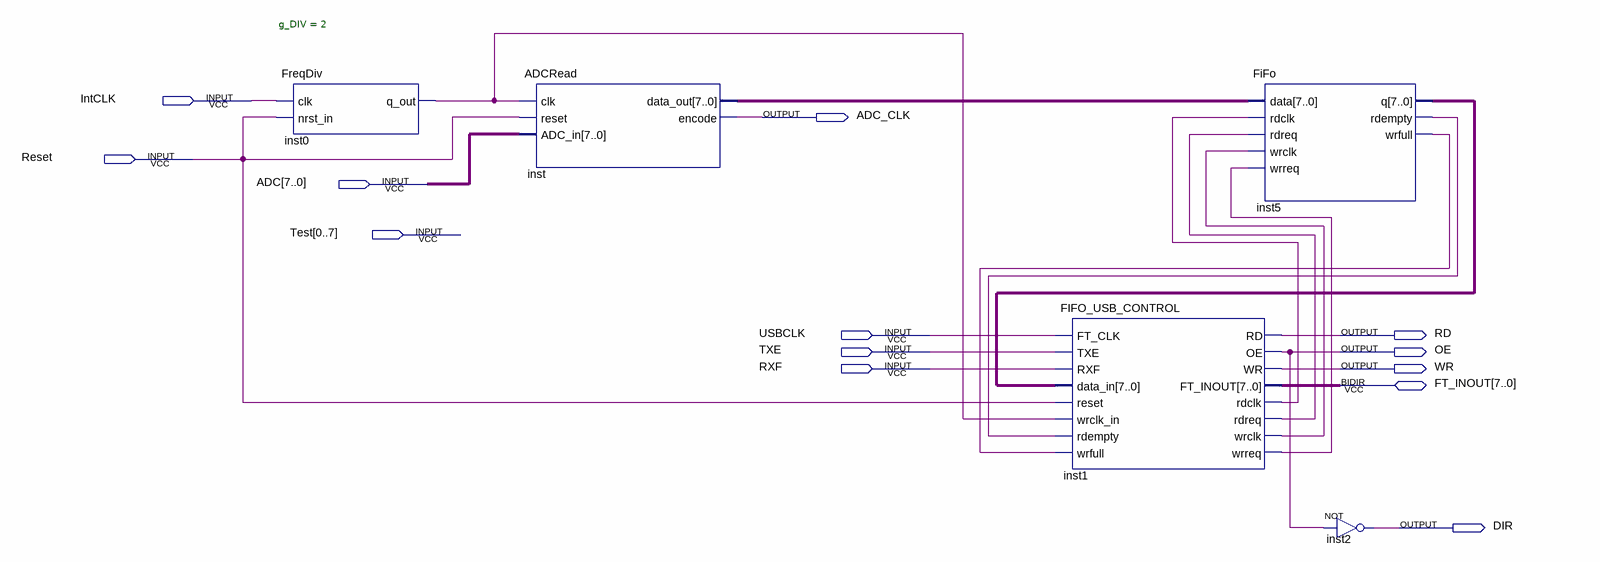
[diagram p0: schematic sheet]
// Quartus schematic ADC_Readout.bdf as structural Verilog: 5 symbols, 13 pins
module ADC_Readout (
  input  IntCLK,
  input  Reset,
  input  [7:0] ADC,
  input  [0:7] Test,
  input  USBCLK,
  input  TXE,
  input  RXF,
  inout  [7:0] FT_INOUT,
  output ADC_CLK,
  output RD,
  output OE,
  output WR,
  output DIR
);

  wire inst0_q_out, inst1_rdclk, inst1_rdreq, inst1_wrclk, inst1_wrreq, inst5_rdempty, inst5_wrfull;
  wire [7:0] inst5_q, inst_data_out;

  FreqDiv #(.g_DIV(2)) inst0 (.clk(IntCLK), .nrst_in(Reset), .q_out(inst0_q_out));
  ADCRead inst (.clk(inst0_q_out), .reset(Reset), .ADC_in(ADC), .data_out(inst_data_out), .encode(ADC_CLK));
  FIFO_USB_CONTROL inst1 (
    .FT_CLK(USBCLK), .TXE(TXE), .RXF(RXF), .data_in(inst5_q), .reset(Reset), .wrclk_in(inst0_q_out),
    .rdempty(inst5_rdempty), .wrfull(inst5_wrfull), .RD(RD), .OE(OE), .WR(WR), .rdclk(inst1_rdclk),
    .rdreq(inst1_rdreq), .wrclk(inst1_wrclk), .wrreq(inst1_wrreq), .FT_INOUT(FT_INOUT));
  FiFo inst5 (
    .data(inst_data_out), .rdclk(inst1_rdclk), .rdreq(inst1_rdreq), .wrclk(inst1_wrclk), .wrreq(inst1_wrreq),
    .q(inst5_q), .rdempty(inst5_rdempty), .wrfull(inst5_wrfull));
  not inst2 (DIR, OE);
endmodule
